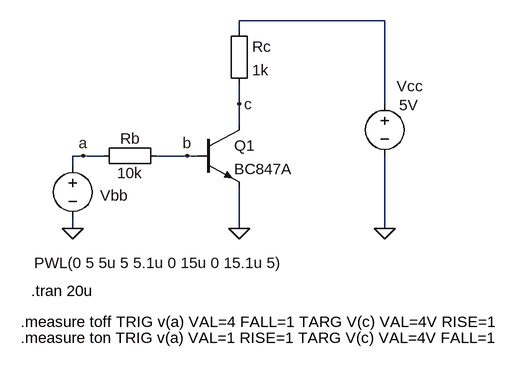
[diagram p0: schematic BT-CE-SWITCH-TOFF-4.asc]
BT-CE-SWITCH-TOFF-4.asc, the LTspice schematic file:
Version 4
SHEET 1 880 680
WIRE 496 -112 272 -112
WIRE 272 -96 272 -112
WIRE 272 16 272 -16
WIRE 496 16 496 -112
WIRE 272 48 272 16
WIRE 32 96 16 96
WIRE 64 96 32 96
WIRE 192 96 144 96
WIRE 208 96 192 96
WIRE 16 112 16 96
WIRE 16 208 16 192
WIRE 272 208 272 144
WIRE 496 208 496 96
FLAG 272 208 0
FLAG 16 208 0
FLAG 496 208 0
FLAG 192 96 b
FLAG 272 16 c
FLAG 32 96 a
SYMBOL Misc\\EuropeanResistor 256 -112 R0
SYMATTR InstName Rc
SYMATTR Value 1k
SYMBOL Misc\\EuropeanResistor 160 80 R90
WINDOW 0 5 56 VBottom 2
WINDOW 3 27 56 VTop 2
SYMATTR InstName Rb
SYMATTR Value 10k
SYMBOL voltage 16 96 R0
WINDOW 3 -59 165 Left 2
WINDOW 123 0 0 Left 2
WINDOW 39 0 0 Left 2
WINDOW 0 42 61 Left 2
SYMATTR Value PWL(0 5 5u 5 5.1u 0 15u 0 15.1u 5)
SYMATTR InstName Vbb
SYMBOL voltage 496 0 R0
WINDOW 3 22 18 Left 2
WINDOW 123 0 0 Left 2
WINDOW 39 0 0 Left 2
WINDOW 0 18 -11 Left 2
SYMATTR Value 5V
SYMATTR InstName Vcc
SYMBOL npn 208 48 R0
SYMATTR InstName Q1
SYMATTR Value BC847A
TEXT -48 304 Left 2 !.tran 20u
TEXT -64 352 Left 2 !.measure toff TRIG v(a) VAL=4 FALL=1 TARG V(c) VAL=4V RISE=1
TEXT -64 376 Left 2 !.measure ton TRIG v(a) VAL=1 RISE=1 TARG V(c) VAL=4V FALL=1

The netlist it stands for:
* BT-CE-SWITCH-TOFF-4.asc
Rc N001 c 1k
Rb b a 10k
Vbb a 0 PWL(0 5 5u 5 5.1u 0 15u 0 15.1u 5)
Vcc N001 0 5V
Q1 c b 0 0 BC847A
.model NPN NPN
.model PNP PNP
.lib standard.bjt
.tran 20u
.measure toff TRIG v(a) VAL=4 FALL=1 TARG V(c) VAL=4V RISE=1
.measure ton TRIG v(a) VAL=1 RISE=1 TARG V(c) VAL=4V FALL=1
.backanno
.end